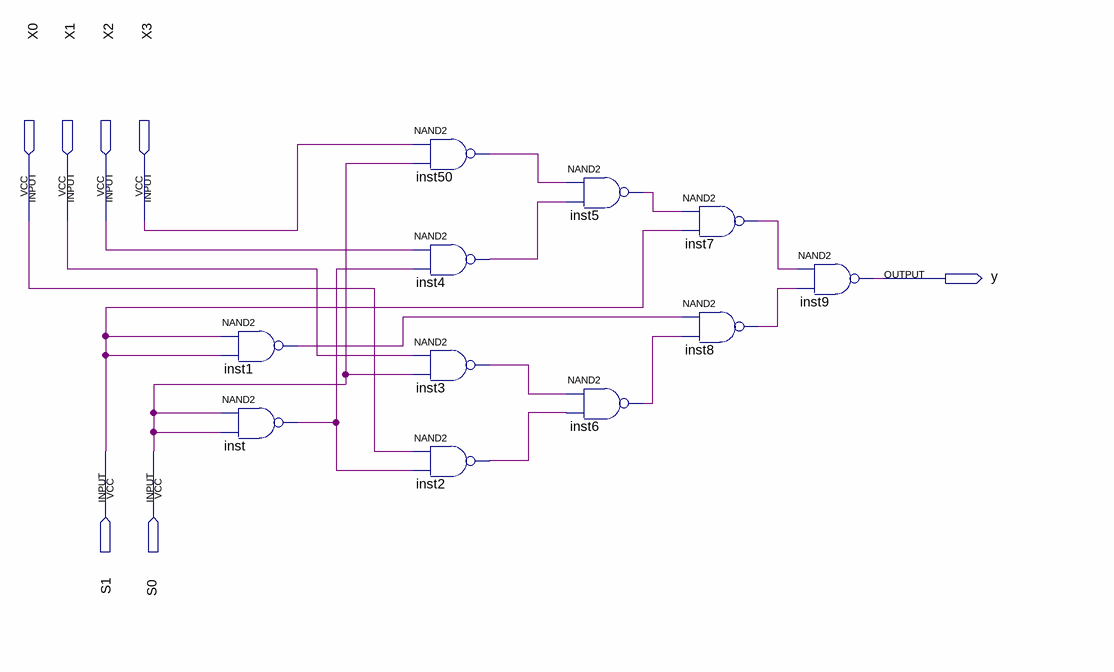
[diagram p0: schematic sheet]
// Quartus schematic Block2.bdf as structural Verilog: 11 symbols, 7 pins
module Block2 (
  input  X0,
  input  X1,
  input  X2,
  input  X3,
  input  S1,
  input  S0,
  output y
);

  wire inst1_out, inst2_out, inst3_out, inst4_out, inst5_out, inst6_out, inst7_out, inst8_out, inst50_out,
       inst_out;

  nand inst1 (inst1_out, S1, S1);
  nand inst (inst_out, S0, S0);
  nand inst50 (inst50_out, X3, S0);
  nand inst4 (inst4_out, X2, inst_out);
  nand inst3 (inst3_out, X1, S0);
  nand inst2 (inst2_out, X0, inst_out);
  nand inst5 (inst5_out, inst50_out, inst4_out);
  nand inst6 (inst6_out, inst3_out, inst2_out);
  nand inst7 (inst7_out, inst5_out, S1);
  nand inst8 (inst8_out, inst1_out, inst6_out);
  nand inst9 (y, inst7_out, inst8_out);
endmodule
